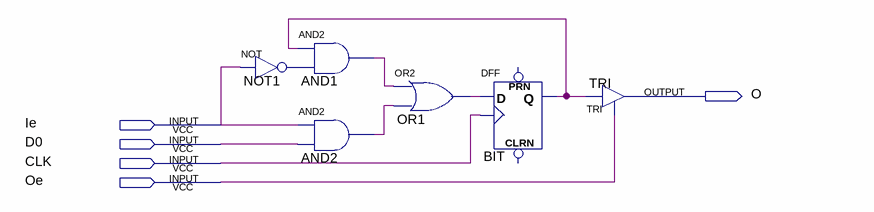
[diagram p0: schematic sheet]
// Quartus schematic CeldaMemoria.bdf as structural Verilog: 6 symbols, 5 pins
module CeldaMemoria (
  input  Ie,
  input  D0,
  input  CLK,
  input  Oe,
  output O
);

  wire AND1_out, AND2_out, BIT_q, NOT1_out, OR1_out;

  not NOT1 (NOT1_out, Ie);
  and AND1 (AND1_out, BIT_q, NOT1_out);
  and AND2 (AND2_out, Ie, D0);
  or OR1 (OR1_out, AND1_out, AND2_out);
  DFF BIT (.CLK(CLK), .D(OR1_out), .Q(BIT_q));  // open: CLRN, PRN
  TRI TRI (.IN(BIT_q), .OE(Oe), .OUT(O));
endmodule
